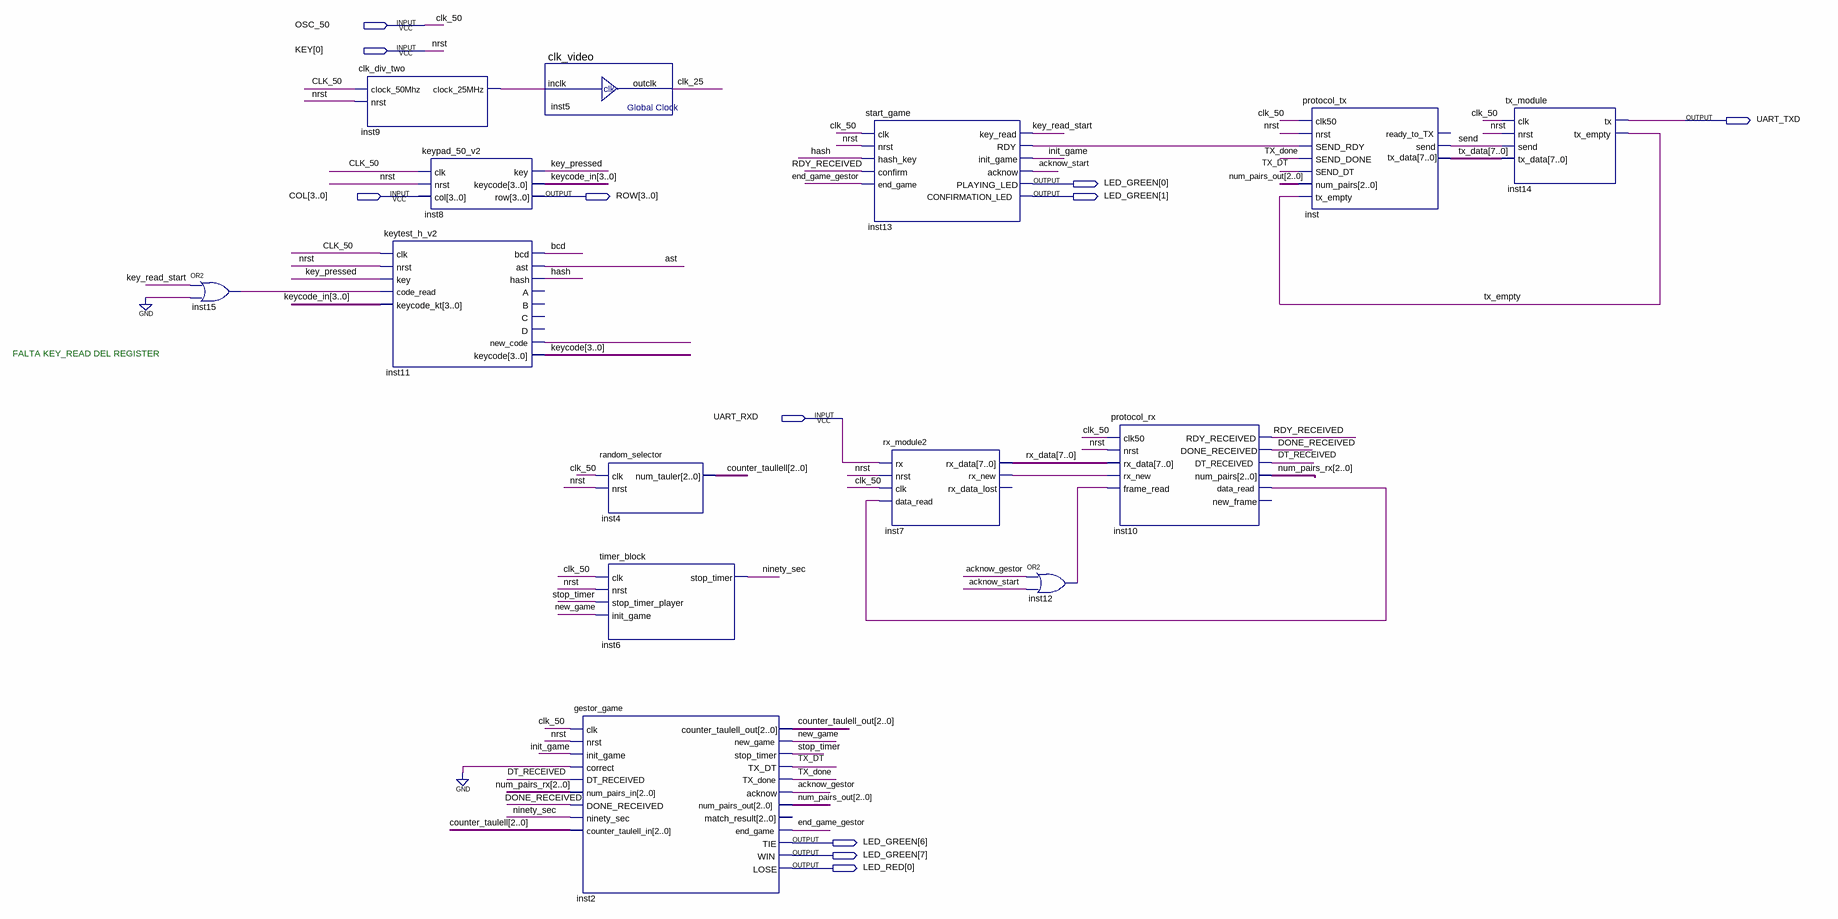
[diagram p0: schematic sheet]
// Quartus schematic sim_tx_beta.bdf as structural Verilog: 14 symbols, 11 pins
module sim_tx_beta (
  input  OSC_50,
  input  [0:0] KEY,
  input  [3:0] COL,
  input  UART_RXD,
  output UART_TXD,
  output [7:0] LED_GREEN,
  output [3:0] ROW,
  output [0:0] LED_RED
);

  wire acknow_gestor, acknow_start, ast, bcd, clk_25, DONE_RECEIVED, DT_RECEIVED, end_game_gestor, hash,
       init_game, inst7_rx_new, inst9_clock_25mhz, inst10_data_read, inst11_new_code, inst12_out, inst13_rdy,
       inst15_out, key_pressed, key_read_start, new_game, ninety_sec, RDY_RECEIVED, send, stop_timer,
       TX_done, TX_DT, tx_empty;
  wire [2:0] counter_taulell, counter_taulell_out, counter_taullell, num_pairs_out, num_pairs_rx;
  wire [3:0] keycode, keycode_in;
  wire [7:0] rx_data, tx_data;

  or inst15 (inst15_out, key_read_start, 1'b0);
  clk_div_two inst9 (.clock_50Mhz(OSC_50), .nrst(KEY[0]), .clock_25MHz(inst9_clock_25mhz));
  keytest_h_v2 inst11 (
    .clk(OSC_50), .nrst(KEY[0]), .key(key_pressed), .code_read(inst15_out), .keycode_kt(keycode_in),
    .bcd(bcd), .ast(ast), .hash(hash), .new_code(inst11_new_code), .keycode(keycode));  // open: A, B, C, D
  keypad_50_v2 inst8 (.clk(OSC_50), .nrst(KEY[0]), .col(COL), .key(key_pressed), .keycode(keycode_in), .row(ROW));
  clk_video inst5 (.inclk(inst9_clock_25mhz), .outclk(clk_25));
  gestor_game inst2 (
    .clk(OSC_50), .nrst(KEY[0]), .init_game(init_game), .correct(1'b0), .DT_RECEIVED(DT_RECEIVED),
    .num_pairs_in(num_pairs_rx), .DONE_RECEIVED(DONE_RECEIVED), .ninety_sec(ninety_sec),
    .counter_taulell_in(counter_taulell), .counter_taulell_out(counter_taulell_out), .new_game(new_game),
    .stop_timer(stop_timer), .TX_DT(TX_DT), .TX_done(TX_done), .acknow(acknow_gestor),
    .num_pairs_out(num_pairs_out), .end_game(end_game_gestor), .TIE(LED_GREEN[6]), .WIN(LED_GREEN[7]),
    .LOSE(LED_RED[0]));  // open: match_result
  random_selector inst4 (.clk(OSC_50), .nrst(KEY[0]), .num_tauler(counter_taullell));
  timer_block inst6 (
    .clk(OSC_50), .nrst(KEY[0]), .stop_timer_player(stop_timer), .init_game(new_game), .stop_timer(ninety_sec));
  start_game inst13 (
    .clk(OSC_50), .nrst(KEY[0]), .hash_key(hash), .confirm(RDY_RECEIVED), .end_game(end_game_gestor),
    .key_read(key_read_start), .RDY(inst13_rdy), .init_game(init_game), .acknow(acknow_start),
    .PLAYING_LED(LED_GREEN[0]), .CONFIRMATION_LED(LED_GREEN[1]));
  rx_module2 inst7 (
    .clk(OSC_50), .nrst(KEY[0]), .rx(UART_RXD), .data_read(inst10_data_read), .rx_data(rx_data),
    .rx_new(inst7_rx_new));  // open: rx_data_lost
  or inst12 (inst12_out, acknow_gestor, acknow_start);
  protocol_rx inst10 (
    .clk50(OSC_50), .nrst(KEY[0]), .rx_data(rx_data), .rx_new(inst7_rx_new), .frame_read(inst12_out),
    .RDY_RECEIVED(RDY_RECEIVED), .DONE_RECEIVED(DONE_RECEIVED), .DT_RECEIVED(DT_RECEIVED),
    .num_pairs(num_pairs_rx), .data_read(inst10_data_read));  // open: new_frame
  protocol_tx inst (
    .clk50(OSC_50), .nrst(KEY[0]), .SEND_RDY(inst13_rdy), .SEND_DONE(TX_done), .SEND_DT(TX_DT),
    .num_pairs(num_pairs_out), .tx_empty(tx_empty), .tx_data(tx_data), .send(send));  // open: ready_to_TX
  tx_module inst14 (.clk(OSC_50), .nrst(KEY[0]), .send(send), .tx_data(tx_data), .tx(UART_TXD), .tx_empty(tx_empty));

  // Other names for the same wires on the sheet: CLK_50 = OSC_50; nrst = KEY[0]

  // Notes on the sheet:
  //   FALTA KEY_READ DEL REGISTER
endmodule
